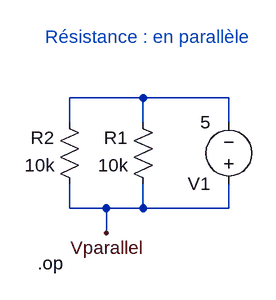
[diagram p0: schematic 03_Resistance_Parallèle.asc]
03_Resistance_Parallèle.asc, the LTspice schematic file:
Version 4.1
SHEET 1 1068 680
WIRE 128 32 32 32
WIRE 240 32 128 32
WIRE 32 64 32 32
WIRE 128 64 128 32
WIRE 240 64 240 32
WIRE 32 176 32 144
WIRE 80 176 32 176
WIRE 128 176 128 144
WIRE 128 176 80 176
WIRE 240 176 240 144
WIRE 240 176 128 176
WIRE 80 208 80 176
FLAG 80 208 Vparallel
SYMBOL voltage 240 160 R180
WINDOW 123 0 0 Left 0
WINDOW 39 0 0 Left 0
SYMATTR InstName V1
SYMATTR Value 5
SYMBOL res 144 160 R180
WINDOW 0 36 76 Left 2
WINDOW 3 36 40 Left 2
SYMATTR InstName R1
SYMATTR Value 10k
SYMBOL res 48 160 R180
WINDOW 0 36 76 Left 2
WINDOW 3 36 40 Left 2
SYMATTR InstName R2
SYMATTR Value 10k
TEXT 0 -48 Left 2 ;Résistance : en parallèle
TEXT 24 248 Right 2 !.op

The netlist it stands for:
* 03_Resistance_Parallèle.asc
V1 Vparallel N001 5
R1 Vparallel N001 10k
R2 Vparallel N001 10k
* Résistance : en parallèle
.op
.backanno
.end